# EAGLE design sensor (EAGLE 6.6.0)
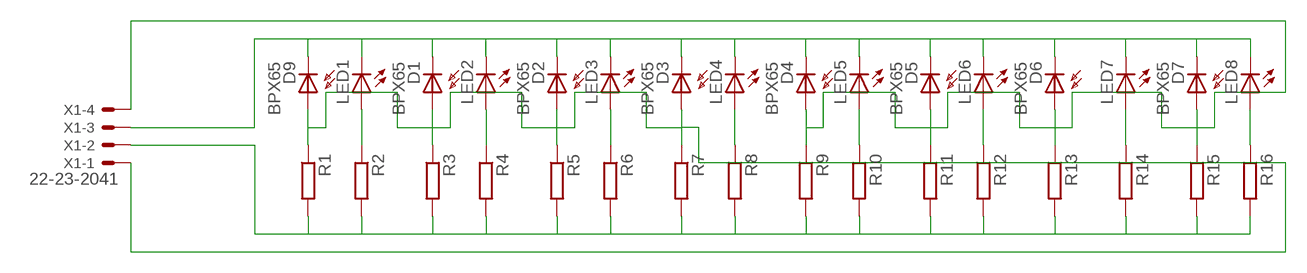
[diagram p0: schematic, sheet 1]

## Parts
D1  BPX65  [BPX65]
D2  BPX65  [BPX65]
D3  BPX65  [BPX65]
D4  BPX65  [BPX65]
D5  BPX65  [BPX65]
D6  BPX65  [BPX65]
D7  BPX65  [BPX65]
D9  BPX65  [BPX65]
LED1  LED3MM  [LED3MM]
LED2  LED3MM  [LED3MM]
LED3  LED3MM  [LED3MM]
LED4  LED3MM  [LED3MM]
LED5  LED3MM  [LED3MM]
LED6  LED3MM  [LED3MM]
LED7  LED3MM  [LED3MM]
LED8  LED3MM  [LED3MM]
R1  R-EU_0204/7  [0204/7]
R2  R-EU_0204/7  [0204/7]
R3  R-EU_0204/7  [0204/7]
R4  R-EU_0204/7  [0204/7]
R5  R-EU_0204/7  [0204/7]
R6  R-EU_0204/7  [0204/7]
R7  R-EU_0204/7  [0204/7]
R8  R-EU_0204/7  [0204/7]
R9  R-EU_0204/7  [0204/7]
R10  R-EU_0204/7  [0204/7]
R11  R-EU_0204/7  [0204/7]
R12  R-EU_0204/7  [0204/7]
R13  R-EU_0204/7  [0204/7]
R14  R-EU_0204/7  [0204/7]
R15  R-EU_0204/7  [0204/7]
R16  R-EU_0204/7  [0204/7]
X1  22-23-2041  [22-23-2041]

## Nets
N$1: D1.A D2.A D3.A D9.A R1.1 R3.1 R5.1 R7.1 X1.1
N$2: LED1.A R2.1
N$4: LED2.A R4.1
N$6: LED3.A R6.1
N$8: LED4.A R8.1
N$9: D4.A D5.A D6.A D7.A R9.1 R11.1 R13.1 R15.1 X1.4
N$10: LED5.A R10.1
N$12: LED6.A R12.1
N$14: LED7.A R14.1
N$16: LED8.A R16.1
N$17: D1.K(C) D2.K(C) D3.K(C) D4.K(C) D5.K(C) D6.K(C) D7.K(C) D9.K(C) LED1.K(C) LED2.K(C) LED3.K(C) LED4.K(C) LED5.K(C) LED6.K(C) LED7.K(C) LED8.K(C) X1.3
N$18: R1.2 R2.2 R3.2 R4.2 R5.2 R6.2 R7.2 R8.2 R9.2 R10.2 R11.2 R12.2 R13.2 R14.2 R15.2 R16.2 X1.2

## Library data of the parts
D1-D7 D9 = opto-trans-siemens:BPX65: PHOTO DIODE; MPN: BPX65.; OC_FARNELL: 327451; OC_NEWARK: 06WX2764
LED1-LED8 = led:LED: LED OSRAM: - CHIPLED LG R971, LG N971, LY N971, LG Q971, LY Q971, LO R971, LY R971 LH N974, LH R974 LS Q976, LO Q976, LY Q976 LO Q996 - Hyper CHIPLED LW Q18S LB Q993, LB Q99A, LB R99A - SideLED LS A670, LO A670, LY A670, LG A670, LP A670 LB A673, LV A673, LT A673, LW A673 LH A674 LY A675 LS A676, LA A676, LO A676, LY A676, LW A676 LS A679, LY A679, LG A679 - Hyper Micro SIDELED® LS Y876, LA Y876, LO Y876, LY Y876 LT Y87S - SmartLED LW L88C, LW L88S LB L89C, LB L89S, LG L890 LS L89K, LO L89K, LY L89K LS L896, LA L896, LO L896, LY L896 - TOPLED LS T670, LO T670, LY T670, LG T670, LP T670 LSG T670, LSP T670, LSY T670, LOP T670, LYG T670 LG T671, LOG T671, LSG T671 LB T673, LV T673, LT T673, LW T673 LH T674 LS T676, LA T676, LO T676, LY T676, LB T676, LH T676, LSB T676, LW T676 LB T67C, LV T67C, LT T67C, LS T67K, LO T67K, LY T67K, LW E67C LS E67B, LA E67B, LO E67B, LY E67B, LB E67C, LV E67C, LT E67C LW T67C LS T679, LY T679, LG T679 LS T770, LO T770, LY T770, LG T770, LP T770 LB T773, LV T773, LT T773, LW T773 LH T774 LS E675, LA E675, LY E675, LS T675 LS T776, LA T776, LO T776, LY T776, LB T776 LHGB T686 LT T68C, LB T68C - Hyper Mini TOPLED® LB M676 - Mini TOPLED Santana® LG M470 LS M47K, LO M47K, LY M47K Source: http://www.osram.convergy.de LUXEON: - LUMILED® LXK2-PW12-R00, LXK2-PW12-S00, LXK2-PW14-U00, LXK2-PW14-V00 LXK2-PM12-R00, LXK2-PM12-S00, LXK2-PM14-U00 LXK2-PE12-Q00, LXK2-PE12-R00, LXK2-PE12-S00, LXK2-PE14-T00, LXK2-PE14-U00 LXK2-PB12-K00, LXK2-PB12-L00, LXK2-PB12-M00, LXK2-PB14-N00, LXK2-PB14-P00, LXK2-PB14-Q00 LXK2-PR12-L00, LXK2-PR12-M00, LXK2-PR14-Q00, LXK2-PR14-R00 LXK2-PD12-Q00, LXK2-PD12-R00, LXK2-PD12-S00 LXK2-PH12-R00, LXK2-PH12-S00 LXK2-PL12-P00, LXK2-PL12-Q00, LXK2-PL12-R00 Source: www.luxeon.com KINGBRIGHT: KA-3528ASYC Source: www.kingbright.com
R1-R16 = rcl:R-EU_: RESISTOR, European symbol
X1 = con-molex:22-23-2041: .100" (2.54mm) Center Header - 4 Pin; MF: MOLEX; MPN: 22-23-2041; OC_FARNELL: 1462920; OC_NEWARK: 38C0355

## Board
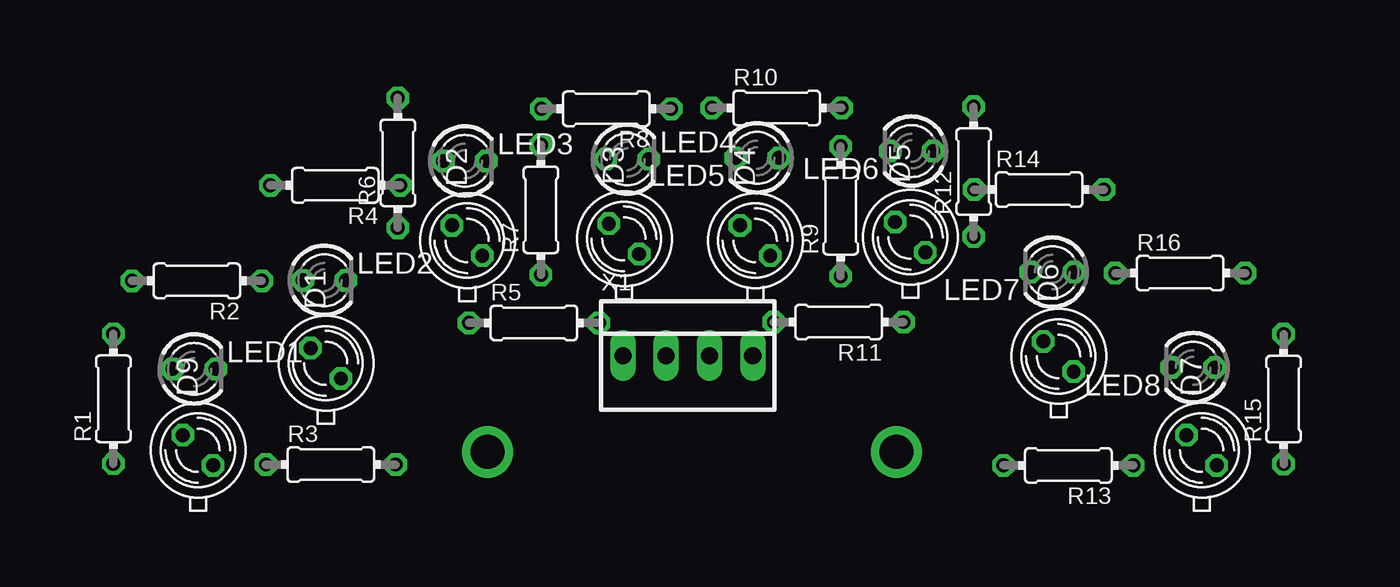
[diagram p1: board, top side]
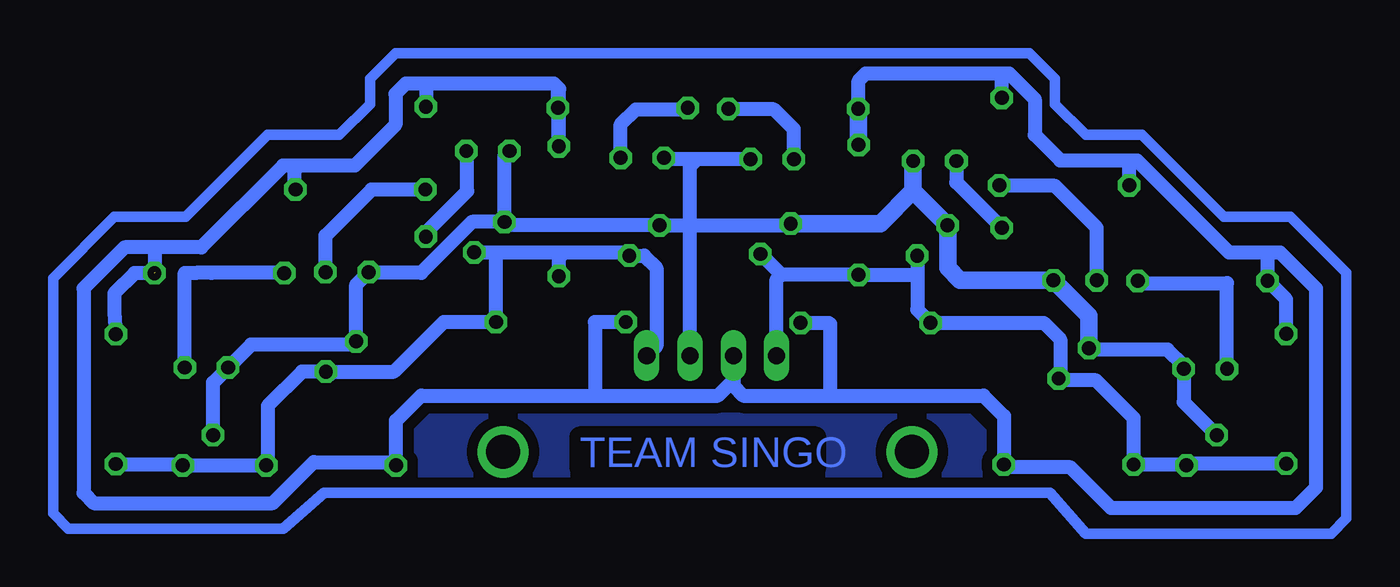
[diagram p2: board, bottom side, seen from below]

No outline drawn. Coordinates in mm, seen from the top.
Copper layers (1*16): Top 0.035mm / dielectric 1.5mm / Bottom 0.035mm
Design rules "default": minimum track width 10mil, minimum drill 24mil, track to track 8mil, track to pad 8mil, pad to pad 8mil, via to via 8mil, smd to smd 8mil, copper to edge 40mil, drill to drill 8mil, minimum pad ring 10mil, minimum via ring 8mil, stop-mask expansion 4mil, vias tented up to drill 0mil, thermal gap 10mil

### Footprints (pad centres in the part's own frame; a part is rotated, then mirrored left to right if it is on the bottom)
BPX65 = drill 0.813 octagon: A -0.889,-0.889; K 0.889,0.889
LED3MM = drill 0.813 octagon: A -1.27,0; K 1.27,0
0204/7 = drill 0.813 octagon: 1 -3.81,0; 2 3.81,0
22-23-2041 = drill 1 long: 1 -3.81,0; 2 -1.27,0; 3 1.27,0; 4 3.81,0

### Placement (x,y rotation side)
D1  7.3,70.3 90 top
D2  15.6,77.5 90 top
D3  24.8,77.6 90 top
D4  32.5,77.5 90 top
D5  41.6,77.7 90 top
D6  50.3,70.7 90 top
D7  58.7,65.2 90 top
D9  -0.2,65.2 90 top
LED1  -0.42,69.97 0 top
LED2  7.22,75.17 0 top
LED3  15.46,82.17 0 top
LED4  25,82.27 0 top
LED5  32.62,82.35 180 top
LED6  41.68,82.75 180 top
LED7  49.94,75.65 180 top
LED8  58.2,70.05 180 top
R1  -5.16,68.22 90 top
R2  -0.26,75.14 180 top
R3  7.6,64.36 0 top
R4  7.86,80.74 180 top
R5  19.52,72.67 0 top
R6  11.53,82.06 90 top
R7  19.93,79.3 90 top
R8  23.76,85.23 180 top
R9  37.52,79.22 90 top
R10  33.76,85.28 0 top
R11  37.4,72.72 180 top
R12  45.32,81.54 90 top
R13  50.88,64.31 180 top
R14  49.16,80.49 0 top
R15  63.51,68.2 90 top
R16  57.44,75.59 0 top
X1  28.55,70.75 0 top

### Tracks (layer width: path | path; a pad name or v marks a point on that pad's centre or on a via)
N$1
  Bottom 0.813: R1.1 0.59,64.41 D9.A | 0.74,64.36 R3.1 3.79,67.09 6,69.3 8.08,69.3 D1.A 8.1,69.5 8.1,71.7 9.07,72.67 R5.1 16.49,73.45 16.49,75.3 | D2.A 16.49,75.3 | 16.49,75.3 16.68,75.49 R7.1 24.47,75.49 | 24.47,75.49 D3.A | X1.1 24.74,75.22 24.47,75.49
  Bottom 1.016: 0.74,64.36 D9.A
N$2
  Bottom 0.813: LED1.A -1.69,75 3.55,75 R2.1
N$4
  Bottom 0.813: LED2.A 5.95,78.25 8.4,80.7 11.63,80.7 R4.1
N$6
  Bottom 0.813: LED3.A 14.19,80.91 R6.1
N$8
  Bottom 0.813: LED4.A 23.73,84.03 24.9,85.2 27.54,85.2 R8.1
N$9
  Bottom 0.813: R15.1 59.67,64.39 D7.A R13.1 54.6,64.7 54.6,67.8 52.59,69.81 D6.A | 50.98,69.6 D6.A | D5.A 41.1,76.81 | 41.1,76.81 37.2,76.81 | 37.2,76.81 33.59,76.81 D4.A 32.51,76.61 31.8,75.9 31.8,71.31 X1.4 | R9.1 37.52,76.49 37.2,76.81 | D6.A 47.19,69.81 44.28,72.72 R11.1 41.21,76.7 41.1,76.81
N$10
  Bottom 0.813: LED5.A 33.89,84.31 33,85.2 30.03,85.2 R10.1
N$12
  Bottom 0.813: R12.1 45.32,77.98 42.9,80.4 42.9,82.7 LED6.A
N$14
  Bottom 0.813: R14.1 48.51,80.49 51.21,77.79 LED7.A
N$16
  Bottom 0.813: R16.1 57.9,75.6 58.8,75.6 59.47,75.6 LED8.A
N$17
  Bottom 0.61: D4.K 30.99,78.39 30.9,78.3 29.82,78.3
  Bottom 0.813: D9.K 0.85,68.03 LED1.K 0.85,70.15 1.8,71.1 6.32,71.1 D1.K | LED4.K 29.4,82.27 | 29.4,82.27 31.27,82.27 LED5.K | D3.K 24.01,78.39 D4.K 40.51,78.39 D5.K | X1.3 29.82,78.3 29.82,81.85 29.4,82.27 | D5.K 40.71,82.45 LED6.K | D5.K 42.61,78.59 45.6,75.6 48.62,75.6 LED7.K 49.41,74.91 D6.K 49.6,71.4 55.58,71.4 LED8.K 57.81,69.17 D7.K
  Bottom 1.016: D1.K 6.41,73.09 LED2.K 13.97,75.17 14.7,75.9 14.7,78.38 D2.K 16.73,80.41 | LED3.K 16.73,80.41 | D3.K 18.65,78.49 16.73,80.41
N$18  (1 unrouted)
  Bottom 0.61: R14.2 53.01,80.49
  Bottom 0.813: R16.2 62.41,75.59 63.6,74.4 63.6,73.3 R15.2 | R7.2 19.93,86.87 19.5,87.3 11.4,87.3 | 11.4,87.3 11.1,87.3 9.6,85.8 9.6,83.7 8.1,82.2 3.9,82.2 | 3.9,82.2 3.6,82.2 -1.8,76.8 -4.2,76.8 | -4.2,76.8 -4.8,76.8 -6.9,74.7 -6.9,63 -5.7,61.8 5.1,61.8 7.5,64.2 11.25,64.2 R3.2 11.4,67.2 12.6,68.4 21.6,68.4 | R1.2 -5.16,74.05 R2.2 -4.07,76.67 -4.2,76.8 | 11.4,87.3 11.53,87.17 R6.2 | X1.2 27.28,69.3 | 27.28,69.3 27.28,68.98 26.7,68.4 21.6,68.4 | R5.2 21.67,72.67 21.6,72.6 21.6,68.4 | 37.57,86.47 R10.2 37.57,83.08 R9.2 37.52,86.38 37.5,86.4 37.57,86.47 | 37.57,86.47 37.8,86.7 45.3,86.7 | 45.3,86.7 45.3,85.37 R12.2 | 35.4,68.4 45.6,68.4 47.07,66.93 R13.2 47.18,64.5 51.9,64.5 54.3,62.1 64.8,62.1 65.4,62.7 65.4,74.7 63,77.1 61.2,77.1 | 35.4,68.4 28.18,68.4 27.28,69.3 | R11.2 35.4,72.72 35.4,68.4 | 45.3,86.7 46.5,86.7 47.1,86.1 47.1,84.3 49.5,81.9 52.8,81.9 | 52.8,81.9 53.7,81.9 58.5,77.1 61.2,77.1 | 61.2,75.6 61.2,77.1 | 4.05,80.69 R4.2 4.05,82.05 3.9,82.2 | 53.01,80.49 53.01,81.69 52.8,81.9
  Bottom 1.016: R7.2 19.95,83.11 R8.2 | R3.2
N$20  (via drill 2)
  other vias: 16.8,65.1
N$21  (via drill 2)
  other vias: 40.8,65.1
N$24
  Bottom 0.61: 47.1,88.5 48.6,87 48.6,85.5 50.4,83.7 54.6,83.7 59.4,78.9 63.6,78.9 67.2,75.3 67.2,61.5 66.3,60.6 53.7,60.6 51.3,62.7 8.7,62.7 6.6,60.3 -7.8,60.3 -8.7,61.2 -8.7,75.6 -5.4,78.9 -1.5,78.9 3.3,83.7 6.6,83.7 8.4,85.5 8.4,87 9.9,88.5 47.1,88.5
N$26
  pour Bottom (isolate 0.61): 12.6,64.2 12.6,66.3 13.5,67.2 45,67.2 45.3,66.9 45.6,66.6 45.9,66.3 45.9,62.7 12.6,62.7

### Text on the board
Bottom: TEAM SINGO